# EAGLE design circuit1 (EAGLE 9.6.2)
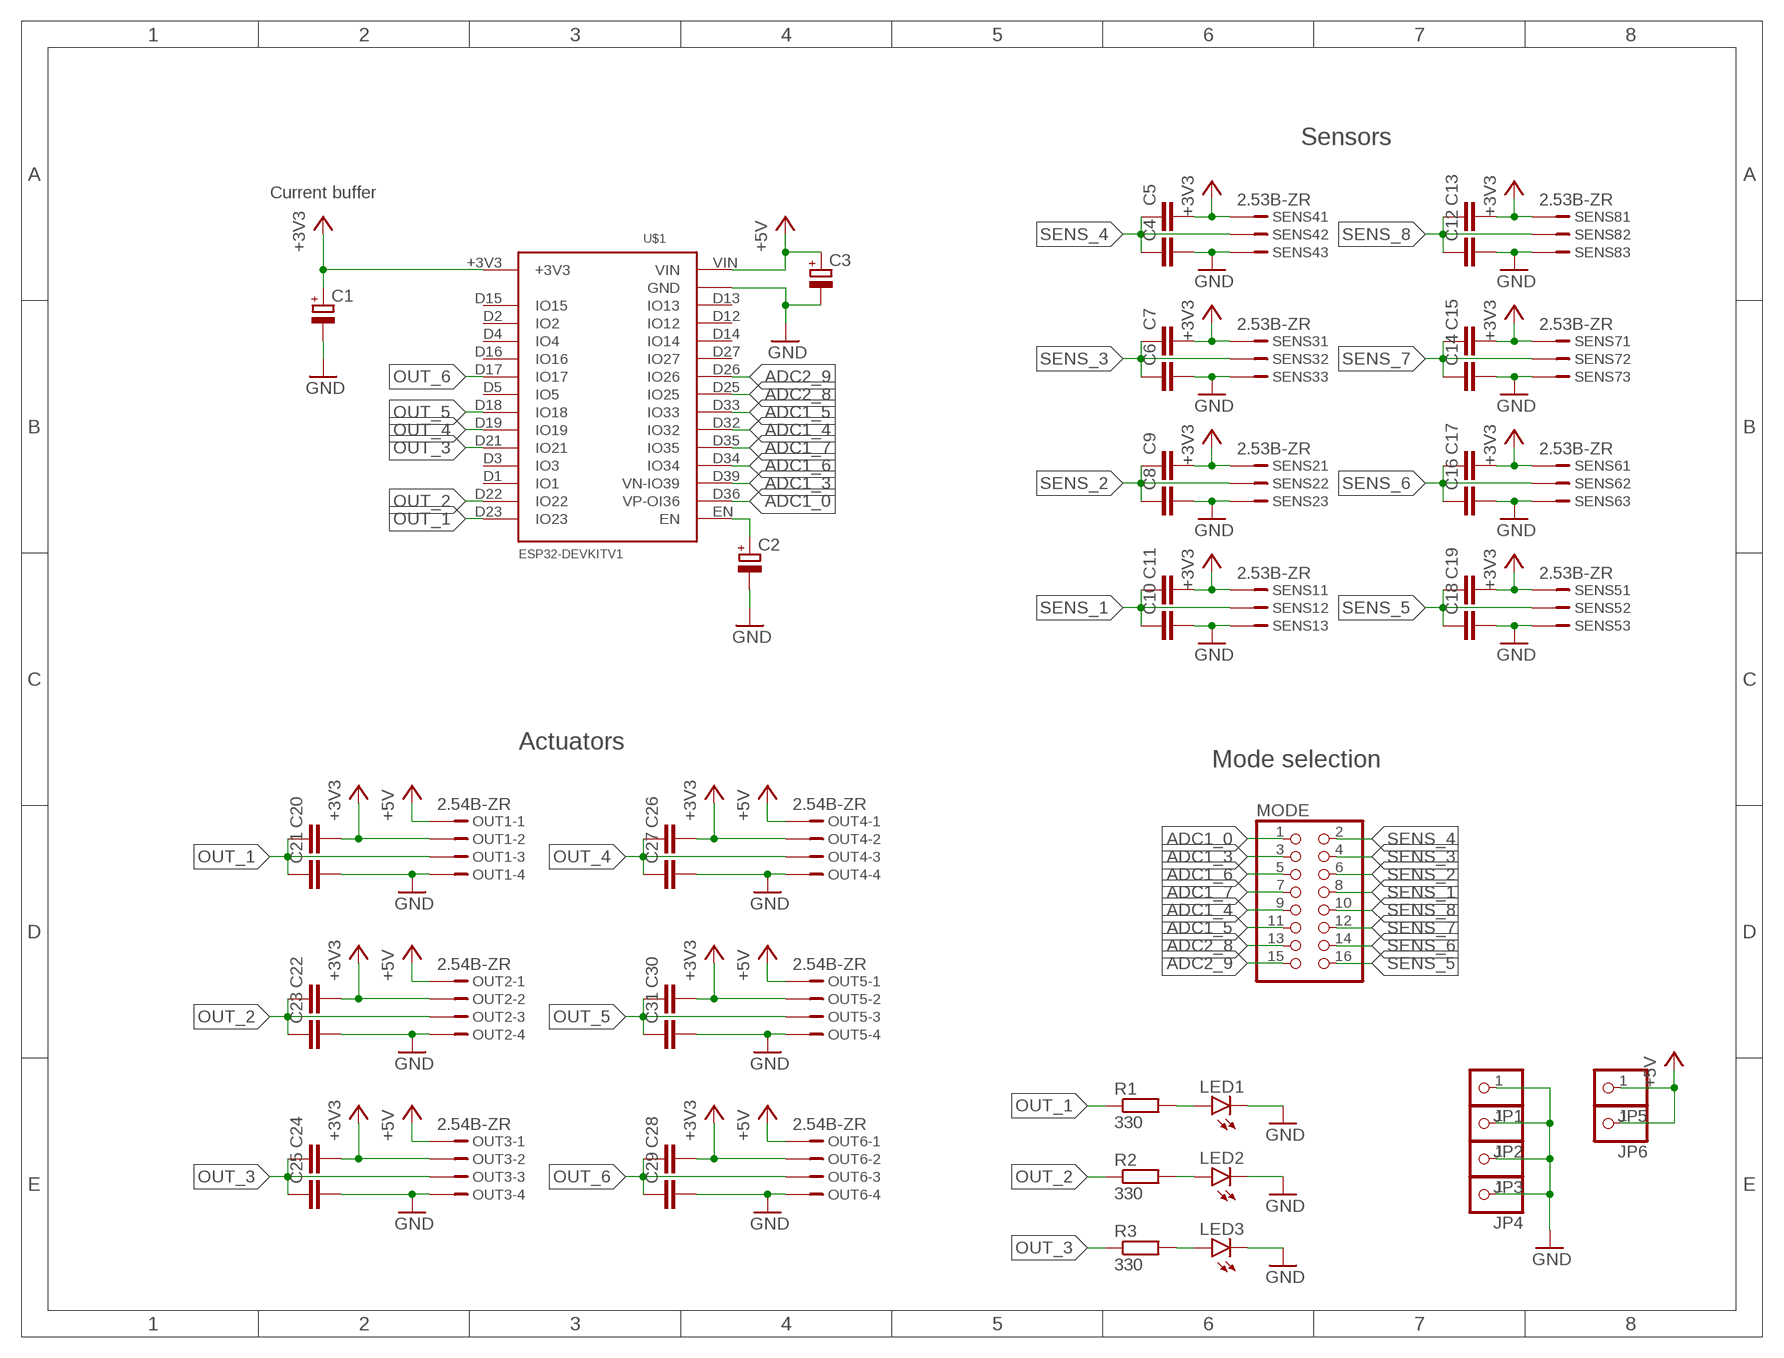
[diagram p0: schematic, sheet 1]

## Parts
C1  CPOL-EUE3.5-8  [E3,5-8]
C2  CPOL-EUE3.5-8  [E3,5-8]
C3  CPOL-EUE3.5-8  [E3,5-8]
C4  C-EU025-030X050  [C025-030X050]
C5  C-EU025-030X050  [C025-030X050]
C6  C-EU025-030X050  [C025-030X050]
C7  C-EU025-030X050  [C025-030X050]
C8  C-EU025-030X050  [C025-030X050]
C9  C-EU025-030X050  [C025-030X050]
C10  C-EU025-030X050  [C025-030X050]
C11  C-EU025-030X050  [C025-030X050]
C12  C-EU025-030X050  [C025-030X050]
C13  C-EU025-030X050  [C025-030X050]
C14  C-EU025-030X050  [C025-030X050]
C15  C-EU025-030X050  [C025-030X050]
C16  C-EU025-030X050  [C025-030X050]
C17  C-EU025-030X050  [C025-030X050]
C18  C-EU025-030X050  [C025-030X050]
C19  C-EU025-030X050  [C025-030X050]
C20  C-EU025-030X050  [C025-030X050]
C21  C-EU025-030X050  [C025-030X050]
C22  C-EU025-030X050  [C025-030X050]
C23  C-EU025-030X050  [C025-030X050]
C24  C-EU025-030X050  [C025-030X050]
C25  C-EU025-030X050  [C025-030X050]
C26  C-EU025-030X050  [C025-030X050]
C27  C-EU025-030X050  [C025-030X050]
C28  C-EU025-030X050  [C025-030X050]
C29  C-EU025-030X050  [C025-030X050]
C30  C-EU025-030X050  [C025-030X050]
C31  C-EU025-030X050  [C025-030X050]
JP1  PINHD-1X1  [1X01]
JP2  PINHD-1X1  [1X01]
JP3  PINHD-1X1  [1X01]
JP4  PINHD-1X1  [1X01]
JP5  PINHD-1X1  [1X01]
JP6  PINHD-1X1  [1X01]
LED1  LED3MM  [LED3MM]
LED2  LED3MM  [LED3MM]
LED3  LED3MM  [LED3MM]
MODE  PINHD-2X8  [2X08]
OUT1  2.54B-ZR  [B4B-ZR2.5]
OUT2  2.54B-ZR  [B4B-ZR2.5]
OUT3  2.54B-ZR  [B4B-ZR2.5]
OUT4  2.54B-ZR  [B4B-ZR2.5]
OUT5  2.54B-ZR  [B4B-ZR2.5]
OUT6  2.54B-ZR  [B4B-ZR2.5]
R1  330  R-EU_0204/7  [0204/7]
R2  330  R-EU_0204/7  [0204/7]
R3  330  R-EU_0204/7  [0204/7]
SENS1  2.53B-ZR  [B3B-ZR2.5]
SENS2  2.53B-ZR  [B3B-ZR2.5]
SENS3  2.53B-ZR  [B3B-ZR2.5]
SENS4  2.53B-ZR  [B3B-ZR2.5]
SENS5  2.53B-ZR  [B3B-ZR2.5]
SENS6  2.53B-ZR  [B3B-ZR2.5]
SENS7  2.53B-ZR  [B3B-ZR2.5]
SENS8  2.53B-ZR  [B3B-ZR2.5]
U$1  ESP32DEVKITV1  [ESP32-DEVKITV1]

## Nets
+3V3: C1.+ C5.2 C7.2 C9.2 C11.2 C13.2 C15.2 C17.2 C19.2 C20.2 C22.2 C24.2 C26.2 C28.2 C30.2 OUT1.2 OUT2.2 OUT3.2 OUT4.2 OUT5.2 OUT6.2 SENS1.1 SENS2.1 SENS3.1 SENS4.1 SENS5.1 SENS6.1 SENS7.1 SENS8.1 U$1.+3V3
+5V: C3.+ JP5.1 JP6.1 OUT1.1 OUT2.1 OUT3.1 OUT4.1 OUT5.1 OUT6.1 U$1.VIN
ADC1_0: MODE.1 U$1.D36(VP-OI36)
ADC1_3: MODE.3 U$1.D39(VN-IO39)
ADC1_4: MODE.9 U$1.D32(IO32)
ADC1_5: MODE.11 U$1.D33(IO33)
ADC1_6: MODE.5 U$1.D34(IO34)
ADC1_7: MODE.7 U$1.D35(IO35)
ADC2_8: MODE.13 U$1.D25(IO25)
ADC2_9: MODE.15 U$1.D26(IO26)
GND: C1.- C2.- C3.- C4.2 C6.2 C8.2 C10.2 C12.2 C14.2 C16.2 C18.2 C21.2 C23.2 C25.2 C27.2 C29.2 C31.2 JP1.1 JP2.1 JP3.1 JP4.1 LED1.K(C) LED2.K(C) LED3.K(C) OUT1.4 OUT2.4 OUT3.4 OUT4.4 OUT5.4 OUT6.4 SENS1.3 SENS2.3 SENS3.3 SENS4.3 SENS5.3 SENS6.3 SENS7.3 SENS8.3 U$1.GND U$1.GND@2(GND)
N$1: C2.+ U$1.EN
N$2: LED1.A R1.2
N$3: LED2.A R2.2
N$4: LED3.A R3.2
OUT_1: C20.1 C21.1 OUT1.3 R1.1 U$1.D23(IO23)
OUT_2: C22.1 C23.1 OUT2.3 R2.1 U$1.D22(IO22)
OUT_3: C24.1 C25.1 OUT3.3 R3.1 U$1.D21(IO21)
OUT_4: C26.1 C27.1 OUT4.3 U$1.D19(IO19)
OUT_5: C30.1 C31.1 OUT5.3 U$1.D18(IO18)
OUT_6: C28.1 C29.1 OUT6.3 U$1.D17(IO17)
SENS_1: C10.1 C11.1 MODE.8 SENS1.2
SENS_2: C8.1 C9.1 MODE.6 SENS2.2
SENS_3: C6.1 C7.1 MODE.4 SENS3.2
SENS_4: C4.1 C5.1 MODE.2 SENS4.2
SENS_5: C18.1 C19.1 MODE.16 SENS5.2
SENS_6: C16.1 C17.1 MODE.14 SENS6.2
SENS_7: C14.1 C15.1 MODE.12 SENS7.2
SENS_8: C12.1 C13.1 MODE.10 SENS8.2
Unconnected: U$1.D1(IO1) U$1.D2(IO2) U$1.D3(IO3) U$1.D4(IO4) U$1.D5(IO5) U$1.D12(IO12) U$1.D13(IO13) U$1.D14(IO14) U$1.D15(IO15) U$1.D16(IO16) U$1.D27(IO27)

## Notes on the sheet
- Sensors
- Current buffer
- Actuators
- Mode selection

## Library data of the parts
C1-C3 = rcl:CPOL-EU: POLARIZED CAPACITOR, European symbol; SPICEPREFIX: C
C4-C31 = rcl:C-EU: CAPACITOR, European symbol; SPICEPREFIX: C
JP1-JP6 = pinhead:PINHD-1X1: PIN HEADER
LED1-LED3 = led:LED: LED OSRAM: - CHIPLED LG R971, LG N971, LY N971, LG Q971, LY Q971, LO R971, LY R971 LH N974, LH R974 LS Q976, LO Q976, LY Q976 LO Q996 - Hyper CHIPLED LW Q18S LB Q993, LB Q99A, LB R99A - SideLED LS A670, LO A670, LY A670, LG A670, LP A670 LB A673, LV A673, LT A673, LW A673 LH A674 LY A675 LS A676, LA A676, LO A676, LY A676, LW A676 LS A679, LY A679, LG A679 - Hyper Micro SIDELED® LS Y876, LA Y876, LO Y876, LY Y876 LT Y87S - SmartLED LW L88C, LW L88S LB L89C, LB L89S, LG L890 LS L89K, LO L89K, LY L89K LS L896, LA L896, LO L896, LY L896 - TOPLED LS T670, LO T670, LY T670, LG T670, LP T670 LSG T670, LSP T670, LSY T670, LOP T670, LYG T670 LG T671, LOG T671, LSG T671 LB T673, LV T673, LT T673, LW T673 LH T674 LS T676, LA T676, LO T676, LY T676, LB T676, LH T676, LSB T676, LW T676 LB T67C, LV T67C, LT T67C, LS T67K, LO T67K, LY T67K, LW E67C LS E67B, LA E67B, LO E67B, LY E67B, LB E67C, LV E67C, LT E67C LW T67C LS T679, LY T679, LG T679 LS T770, LO T770, LY T770, LG T770, LP T770 LB T773, LV T773, LT T773, LW T773 LH T774 LS E675, LA E675, LY E675, LS T675 LS T776, LA T776, LO T776, LY T776, LB T776 LHGB T686 LT T68C, LB T68C - Hyper Mini TOPLED® LB M676 - Mini TOPLED Santana® LG M470 LS M47K, LO M47K, LY M47K Source: http://www.osram.convergy.de LUXEON: - LUMILED® LXK2-PW12-R00, LXK2-PW12-S00, LXK2-PW14-U00, LXK2-PW14-V00 LXK2-PM12-R00, LXK2-PM12-S00, LXK2-PM14-U00 LXK2-PE12-Q00, LXK2-PE12-R00, LXK2-PE12-S00, LXK2-PE14-T00, LXK2-PE14-U00 LXK2-PB12-K00, LXK2-PB12-L00, LXK2-PB12-M00, LXK2-PB14-N00, LXK2-PB14-P00, LXK2-PB14-Q00 LXK2-PR12-L00, LXK2-PR12-M00, LXK2-PR14-Q00, LXK2-PR14-R00 LXK2-PD12-Q00, LXK2-PD12-R00, LXK2-PD12-S00 LXK2-PH12-R00, LXK2-PH12-S00 LXK2-PL12-P00, LXK2-PL12-Q00, LXK2-PL12-R00 Source: www.luxeon.com KINGBRIGHT: KA-3528ASYC Source: www.kingbright.com
MODE = pinhead:PINHD-2X8: PIN HEADER
OUT1-OUT6 = samuel:?4B-ZR: ZH CONNECTOR 1.5 mm, 4 pin 1 row Source: http://www.jst.com .. eZH.pdf
R1-R3 = rcl:R-EU_: RESISTOR, European symbol; SPICEPREFIX: R
SENS1-SENS8 = samuel:?3B-ZR: ZH CONNECTOR 1.5 mm, 4 pin 1 row Source: http://www.jst.com .. eZH.pdf
U$1 = samuel:ESP32DEVKITV1

## Board
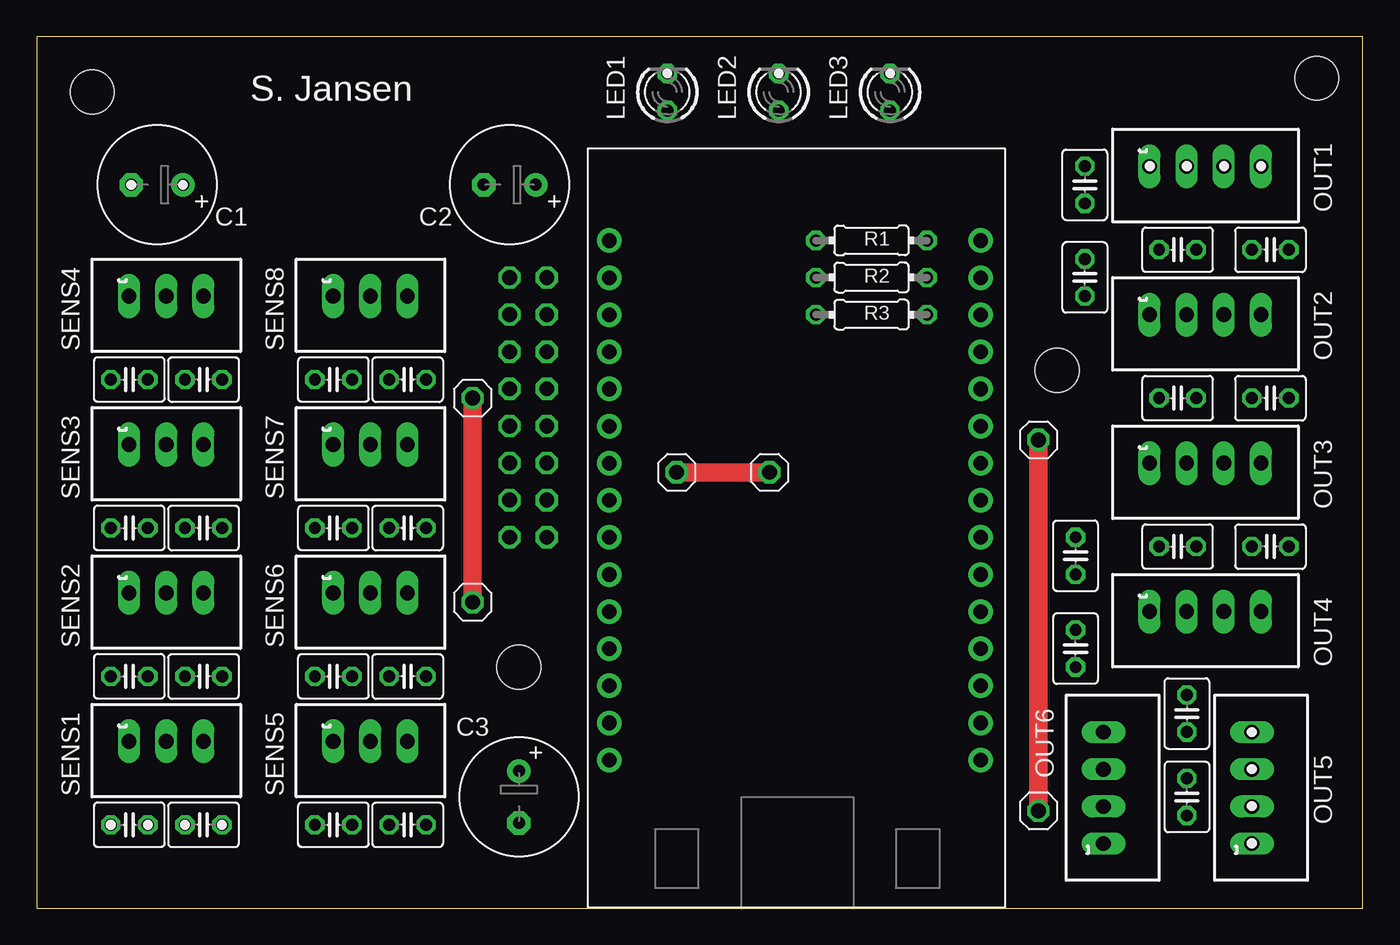
[diagram p1: board, top side]
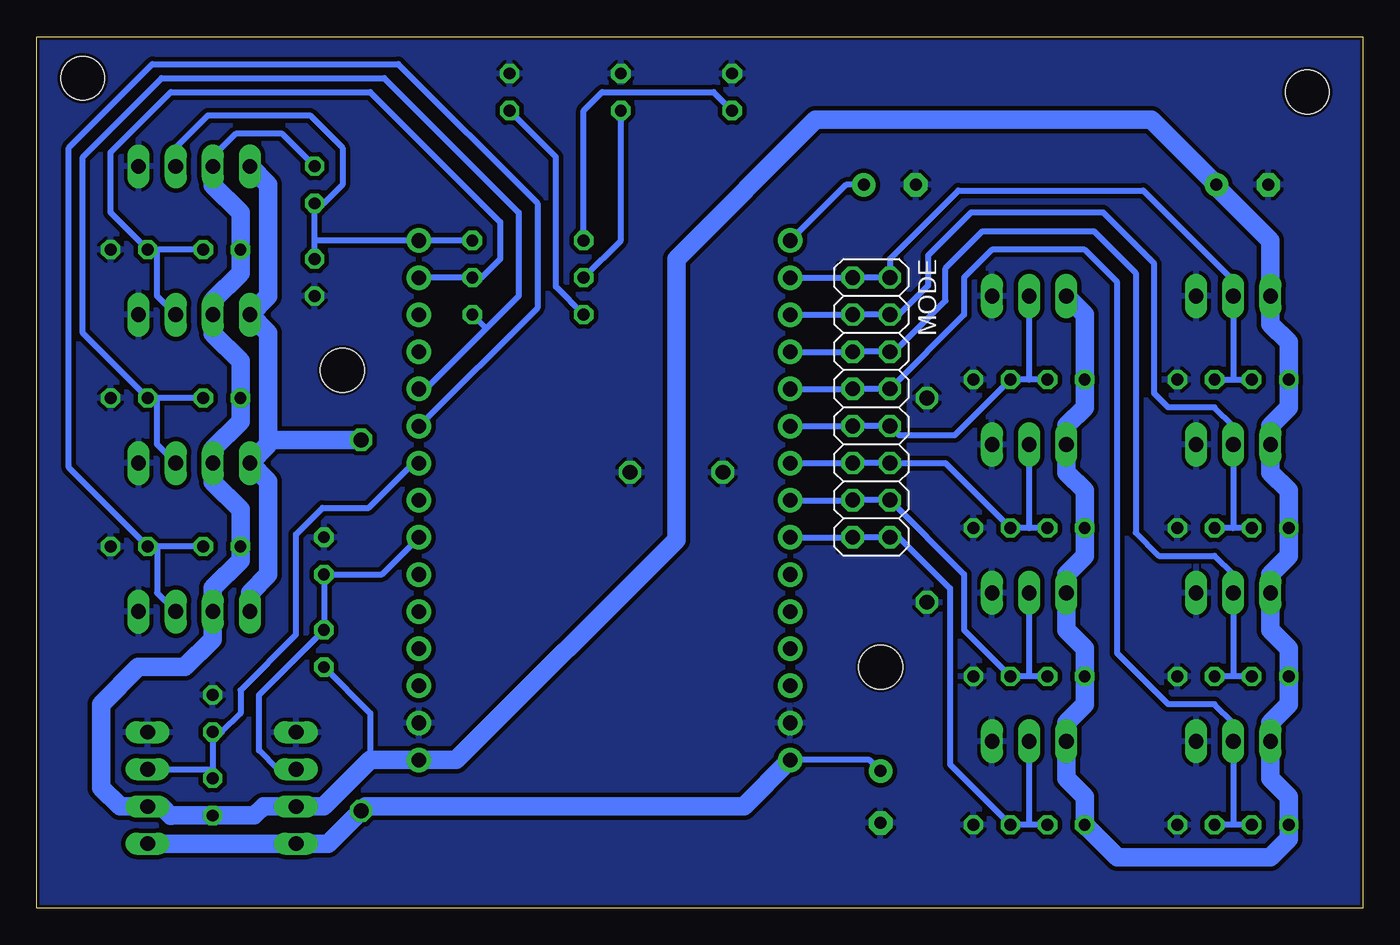
[diagram p2: board, bottom side, seen from below]

Size 90.79 x 59.68 mm. Coordinates in mm from the lower left corner, seen from the top.
Outline: 0,0 90.79,0 90.79,59.68 0,59.68 0,0
Copper layers (1*16): Top 0.035mm / dielectric 1.5mm / Bottom 0.035mm
Design rules "home-made-pcb": minimum track width 8mil, minimum drill 0.3mm, track to track 12mil, track to pad 8mil, pad to pad 10mil, via to via 10mil, smd to smd 6mil, copper to edge 8mil, drill to drill 10mil, minimum pad ring 10mil, minimum via ring 20mil, stop-mask expansion 4mil, vias tented up to drill 0mil, thermal gap 10mil
Holes 3 mm at 3.81,55.88 69.85,36.83 33.02,16.51 87.63,56.83

### Footprints (pad centres in the part's own frame; a part is rotated, then mirrored left to right if it is on the bottom)
E3,5-8 = drill 0.813 pad 1.6: + -1.778,0 | drill 0.813 pad 1.6 octagon: - 1.778,0
C025-030X050 = drill 0.813 octagon: 1 -1.27,0; 2 1.27,0
1X01 = drill 1.016 octagon: 1 0,0
LED3MM = drill 0.813 octagon: A -1.27,0; K 1.27,0
2X08 = drill 1.016 octagon: 1 -8.89,-1.27; 2 -8.89,1.27; 3 -6.35,-1.27; 4 -6.35,1.27; 5 -3.81,-1.27; 6 -3.81,1.27; 7 -1.27,-1.27; 8 -1.27,1.27; 9 1.27,-1.27; 10 1.27,1.27; 11 3.81,-1.27; 12 3.81,1.27; 13 6.35,-1.27; 14 6.35,1.27; 15 8.89,-1.27; 16 8.89,1.27
B4B-ZR2.5 = drill 1 pad 1.422 long: 1 -3.825,0; 2 -1.283,0; 3 1.257,0; 4 3.797,0
0204/7 = drill 0.813 octagon: 1 -3.81,0; 2 3.81,0
B3B-ZR2.5 = drill 1 pad 1.422 long: 1 -2.555,0; 2 -0.013,0; 3 2.527,0
ESP32-DEVKITV1 = drill 1 pad 1.676: +3V3 -15.25,-12.54; D1 15.23,-12.54; D2 -7.63,-12.54; D3 12.69,-12.54; D4 -5.09,-12.54; D5 2.53,-12.54; D12 -7.63,12.865; D13 -10.17,12.865; D14 -5.09,12.865; D15 -10.17,-12.54; D16 -2.55,-12.54; D17 -0.01,-12.54; D18 5.07,-12.54; D19 7.61,-12.54; D21 10.15,-12.54; D22 17.77,-12.54; D23 20.31,-12.54; D25 2.53,12.865; D26 -0.01,12.865; D27 -2.55,12.865; D32 7.61,12.865; D33 5.07,12.865; D34 12.69,12.865; D35 10.15,12.865; D36 17.77,12.865; D39 15.23,12.865; EN 20.31,12.865; GND -12.71,12.865; GND@2 -12.71,-12.54; VIN -15.25,12.865

### Placement (x,y rotation side)
C1  8.26,49.53 180 top
C2  32.38,49.53 180 top
C3  33.02,7.62 270 top
C4  11.43,36.2 0 top
C5  6.35,36.2 180 top
C6  11.43,26.04 0 top
C7  6.35,26.04 180 top
C8  11.43,15.88 0 top
C9  6.35,15.88 180 top
C10  11.43,5.71 0 top
C11  6.35,5.71 180 top
C12  25.4,36.2 0 top
C13  20.32,36.2 180 top
C14  25.4,26.04 0 top
C15  20.32,26.04 180 top
C16  25.4,15.88 0 top
C17  20.32,15.88 180 top
C18  25.4,5.71 0 top
C19  20.32,5.71 180 top
C20  71.75,49.53 90 top
C21  71.75,43.18 270 top
C22  78.11,45.09 180 top
C23  84.45,45.09 0 top
C24  78.11,34.92 180 top
C25  84.45,34.92 0 top
C26  78.11,24.77 180 top
C27  84.45,24.77 0 top
C28  71.12,17.78 270 top
C29  71.12,24.13 90 top
C30  78.74,7.62 270 top
C31  78.74,13.34 90 top
JP1  29.84,20.95 0 top
JP2  29.84,34.92 0 top
JP3  43.81,29.84 0 top
JP4  50.16,29.84 0 top
JP5  68.58,32.07 0 top
JP6  68.58,6.67 0 top
LED1  43.18,55.88 90 top
LED2  50.8,55.88 90 top
LED3  58.42,55.88 90 top
MODE  33.66,34.29 270 bottom
OUT1  80.01,50.8 0 top
OUT2  80.01,40.64 0 top
OUT3  80.01,30.48 0 top
OUT4  80.01,20.32 0 top
OUT5  83.19,8.26 90 top
OUT6  73.03,8.26 90 top
R1  57.15,45.72 180 top
R2  57.15,43.18 180 top
R3  57.15,40.64 180 top
SENS1  8.89,11.43 0 top
SENS2  8.89,21.59 0 top
SENS3  8.89,31.75 0 top
SENS4  8.89,41.91 0 top
SENS5  22.86,11.43 0 top
SENS6  22.86,21.59 0 top
SENS7  22.86,31.75 0 top
SENS8  22.86,41.91 0 top
U$1  52.07,25.4 90 top

### Tracks (layer width: path | path; a pad name or v marks a point on that pad's centre or on a via)
+3V3
  Bottom 0.406: C20.2 73.98,53.02 77.15,53.02 78.73,51.45 OUT1.2 | C28.2 67.95,13.35 67.95,10.15
  Bottom 1.27: SENS8.1 19.05,40.66 C13.2 19.05,34.29 20.3,33.03 SENS7.1 20.3,29.84 19.05,28.59 C15.2 19.05,24.11 20.3,22.86 SENS6.1 20.3,19.05 19.05,17.8 C17.2 19.05,13.96 20.3,12.7 SENS5.1 20.3,8.89 19.05,7.63 C19.2 16.83,3.49 6.35,3.49 5.08,4.76 C11.2 5.08,7.63 6.33,8.89 SENS1.1 6.33,12.7 5.08,13.96 C9.2 5.08,17.8 6.33,19.05 SENS2.1 6.33,22.86 5.08,24.11 C7.2 5.08,28.59 6.33,29.84 SENS3.1 6.33,33.02 5.08,34.27 C5.2 5.08,38.75 6.33,40.01 SENS4.1 6.33,45.7 10.03,49.4 C1.+ 14.48,53.98 37.47,53.98 46.99,44.45 46.99,25.23 62.07,10.15 U$1.+3V3 67.95,10.15 71.13,6.97 OUT6.2 | OUT1.2 78.73,49.52 76.83,47.62 C22.2 76.83,43.5 78.73,41.61 OUT2.2 78.73,39.36 76.83,37.47 C24.2 76.83,33.34 78.73,31.45 OUT3.2 78.73,29.2 76.83,27.3 C26.2 76.83,23.81 78.73,21.92 OUT4.2 78.74,20.31 78.74,18.41 80.64,16.51 83.82,16.51 86.36,13.97 86.36,8.26 85.08,6.97 OUT5.2 82.23,6.97 81.6,6.34 81.58,6.34 81.57,6.35 C30.2 75.88,6.35 75.26,6.97 OUT6.2 | OUT6.2 73.03,6.99
+5V
  Top 1.27: JP5.1 JP6.1
  Bottom 0.406: C3.+ 33.77,10.15 U$1.VIN
  Bottom 1.27: OUT4.1 76.19,21.59 74.93,22.84 74.93,29.23 OUT3.1 74.93,31.73 74.93,32.07 | 74.93,32.07 74.93,39.38 OUT2.1 74.93,41.9 74.93,49.55 OUT1.1 | OUT5.1 OUT6.1 | OUT6.1 73.06,4.43 73.04,4.45 | OUT6.1 70.82,4.43 JP6.1 68.26,6.99 42.37,6.99 U$1.VIN | JP5.1 74.93,32.07
ADC1_0
  Bottom 0.406: U$1.D36 MODE.1
ADC1_3
  Bottom 0.406: U$1.D39 MODE.3
ADC1_4
  Bottom 0.406: U$1.D32 MODE.9
ADC1_5
  Bottom 0.406: U$1.D33 MODE.11
ADC1_6
  Bottom 0.406: U$1.D34 MODE.5
ADC1_7
  Bottom 0.406: U$1.D35 MODE.7
ADC2_8
  Bottom 0.406: U$1.D25 MODE.13
ADC2_9
  Bottom 0.406: U$1.D26 MODE.15
GND
  Top 1.27: JP3.1 JP4.1 | JP2.1 JP1.1
  pour Bottom: -3.81,86.36 109.22,86.36 109.22,-1.27 -3.81,-1.27
N$1
  Bottom 0.406: C2.+ 35.38,49.53 U$1.EN
N$2
  Bottom 0.406: R1.2 53.34,54.61 52.07,55.88 44.45,55.88 LED1.A
N$3
  Bottom 0.406: R2.2 50.8,45.72 LED2.A
N$4
  Bottom 0.406: R3.2 55.24,42.55 55.24,51.44 LED3.A
N$5
  cutout Bottom (rank 2): 31.43,44.13 35.88,44.13 35.88,24.45 31.43,24.45
OUT_1
  Bottom 0.406: OUT1.3 81.27,52.06 81.28,52.07 79.06,54.29 72.07,54.29 69.85,52.07 69.85,49.53 71.12,48.26 C20.1 71.75,45.72 | C21.1 71.75,45.72 | U$1.D23 64.77,45.71 | 64.77,45.71 71.75,45.71 71.75,45.72 | R1.1 64.76,45.72 64.77,45.71
OUT_2
  Bottom 0.406: C22.1 82.55,45.09 | 82.55,45.09 C23.1 85.72,47.62 85.72,51.75 81.6,55.88 67.94,55.88 59.05,46.99 59.05,44.45 60.33,43.18 R2.1 U$1.D22 | OUT2.3 82.55,41.92 82.55,45.09
OUT_3
  Bottom 0.406: C24.1 82.55,34.92 | 82.55,34.92 C25.1 87.63,39.37 87.63,51.44 82.23,56.83 66.99,56.83 57.78,47.62 57.78,41.91 60.01,39.69 | OUT3.3 82.55,31.76 82.55,34.92 | 60.01,39.69 R3.1 | 60.01,39.69 64.14,35.55 U$1.D21
OUT_4
  Bottom 0.406: C26.1 82.55,24.77 | 82.55,24.77 C27.1 88.58,30.16 88.58,52.07 82.87,57.78 66.04,57.78 56.52,48.26 56.52,41.1 U$1.D19 | OUT4.3 82.54,21.59 82.54,24.75 82.55,24.77
OUT_5
  Bottom 0.406: 78.74,9.53 C31.1 78.11,12.06 76.83,13.34 76.83,14.92 73.03,18.73 73.03,25.6 71.22,27.41 68.05,27.41 64.98,30.47 U$1.D18 | 78.74,9.53 C30.1 | OUT5.3 78.75,9.51 78.74,9.53
OUT_6
  Bottom 0.406: C28.1 C29.1 67.14,22.86 U$1.D17 | 71.12,19.04 C28.1 | OUT6.3 73.04,9.53 74.3,9.53 75.56,10.79 75.56,14.61 C28.1
SENS_1
  Bottom 0.406: C11.1 8.89,5.71 | 8.89,5.71 C10.1 | 8.89,5.71 8.89,11.42 SENS1.2 8.88,12.69 10.16,13.97 13.34,13.97 16.83,17.46 16.83,42.86 19.05,45.09 25.4,45.09 27.3,43.18 27.3,40.64 MODE.8 34.92,35.56
SENS_2
  Bottom 0.406: C9.1 8.89,15.88 | 8.89,15.88 C8.1 | 8.89,15.88 8.89,21.58 SENS2.2 8.88,22.85 10.16,24.13 13.97,24.13 15.56,25.72 15.56,43.5 18.41,46.35 26.04,46.35 28.57,43.81 28.57,41.59 32.07,38.1 MODE.6 34.92,38.1
SENS_3
  Bottom 0.406: C7.1 8.89,26.04 | 8.89,26.04 C6.1 | 8.89,26.04 8.89,31.74 SENS3.2 8.88,33.01 10.16,34.29 13.34,34.29 14.29,35.24 14.29,44.13 17.78,47.62 26.82,47.62 29.77,44.68 29.77,42.62 31.75,40.64 MODE.4 34.92,40.64
SENS_4
  Bottom 0.406: 8.89,36.2 8.89,41.9 SENS4.2 8.88,42.96 15.05,49.14 27.7,49.14 32.38,44.45 MODE.2 34.92,43.18 | 8.89,36.2 C5.1 | C4.1 8.89,36.2
SENS_5
  Bottom 0.406: C19.1 22.86,5.71 | 22.86,5.71 C18.1 28.26,9.84 28.26,21.91 31.75,25.4 MODE.16 34.92,25.4 | SENS5.2 22.86,11.42 22.86,5.71
SENS_6
  Bottom 0.406: C17.1 22.86,15.88 | 22.86,15.88 C16.1 27.3,19.05 27.3,22.86 MODE.14 34.92,27.94 | SENS6.2 22.86,21.58 22.86,15.88
SENS_7
  Bottom 0.406: C15.1 22.86,26.04 | 22.86,26.04 C14.1 28.57,30.48 MODE.12 34.92,30.48 | SENS7.2 22.86,31.74 22.86,26.04
SENS_8
  Bottom 0.406: C13.1 22.86,36.2 | 22.86,36.2 C12.1 27.94,32.38 31.75,32.38 MODE.10 34.92,33.02 | SENS8.2 22.86,41.9 22.86,36.2

### Text on the board
tNames: S. Jansen